# Altium project Marsault1.PrjPcb (part 7 of 7)

## Sheet Buzzer.SchDoc
size A4; SheetNumber: 8; SheetTotal: 9
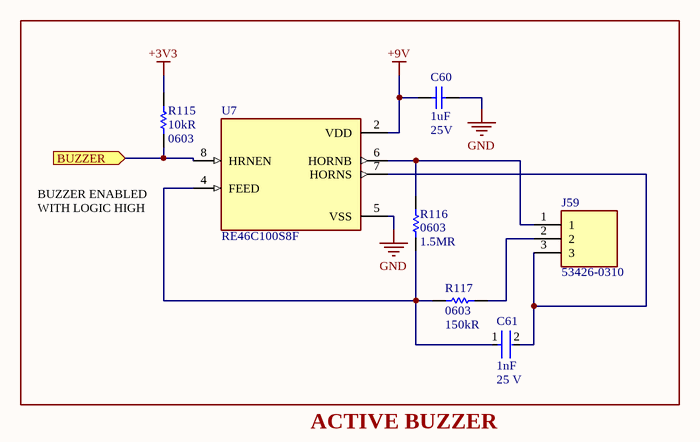
[diagram p7: Buzzer.SchDoc]

### Parts
C60  Capacitance: 1uF  Voltage Rating (DC): 25V  [CAPC1608X90X35LL15T15]  (hidden comment: C0603C105K3PAC7867)
C61  Capacitance: 1nF  Voltage Rating: 25 V  [FP-C0603C-CF-MFG]  (hidden comment: C0603C102J3GACTU)
J59  53426-0310  [534260310]
R115  Resistance: 10kR  Case Code (Imperial): 0603  [RESC1609X55X30LL15T15]  (hidden comment: ERJ3EKF1002V)
R116  Case Code (Imperial): 0603  Resistance: 1.5MR  [RESC1608X55X30ML15T15]  (hidden comment: ERJ-3GEYJ155V)
R117  Case Code (Imperial): 0603  Resistance: 150kR  [RESC1608X55X30NL15T15]  (hidden comment: ERJ-3EKF1503V)
U7  RE46C100S8F  [SOIC127P600X175-8N]

### Ports
BUZZER (in)

### Nets
+3V3: R115.2
+9V: C60.2 U7.2(VDD)
GND: C60.1 U7.5(VSS)
BUZZER: R115.1 U7.8(HRNEN) ; port BUZZER
NetC61_1: C61.1 R116.1 R117.1 U7.4(FEED)
NetC61_2: C61.2 J59.3 U7.7(HORNS)
NetJ59_1: J59.1 R116.2 U7.6(HORNB)
NetJ59_2: J59.2 R117.2

### Notes on the sheet
- BUZZER ENABLED WITH LOGIC HIGH
- ACTIVE BUZZER

### Library data of the parts
C60 = CMP-2006-02216-2: Manufacturer: Kemet; Manufacturer Part Number: C0603C105K3PACTU; Dielectric Material: Ceramic; Tolerance: 10%; Dielectric: X5R; Part Number: C0603C105K3PAC7867; Supplier 1: Mouser; Supplier Part Number 1: 80-C0603C105K3P; RoHS: Yes; Category: Ceramic Capacitors; Stock 1: 10085; Pricing 1: 1=0,30000, 10=0,15600, 50=0,15600, 100=0,09300, 500=0,08200, 1000=0,07300, 4000=0,05700, 10000=0,05700 (USD); Mount: Surface Mount,PCB; Case/Package: 0603; Number of Pins: 2; Case Code (Imperial): 0603; Case Code (Metric): 1608; Contact Plating: Tin,Matte; Min Operating Temperature: -55°C; Max Operating Temperature: 85°C; Packaging: Tape and Reel; Termination: SMD/SMT; Voltage Rating: 25V; Package Quantity: 4000; Voltage: 25V; Series: C0603C; Construction: Flat; Length: 1.6mm; Width: 0.031inch; Height: 0.8mm; Depth: 0.8mm; Thickness: 0.034inch; Radiation Hardening: No; REACH SVHC: No SVHC; RoHS Compliant: Yes; Lead Free: Lead Free; ComponentLink1URL: https://datasheet.ciiva.com/5998/40889-5998745.pdf?src-supplier=Farnell; ComponentLink1Description: https://datasheet.ciiva.com/5998/40889-5998745.pdf?src-supplier=Farnell; ComponentLink2URL: https://datasheet.ciiva.com/28610/1918694-28610792.pdf?src-supplier=Element14; ComponentLink2Description: https://datasheet.ciiva.com/28610/1918694-28610792.pdf?src-supplier=Element14
C61 = CMP-2006-03010-2: CAP CER 1000PF 25V 5% NP0 0603; Manufacturer: KEMET; Value: 1,000 pF; Tolerance: 0.05; Temperature Characteristic: C0G; Temperature Coefficient: 30ppm/°C; Automotive Grade: Grade 1; Material: Ceramic; Category: Cap; Device Class L2: Capacitors; Octopart: https://octopart.com/c0603c102j3gactu-kemet-8375722; ComponentLink2URL: https://api.kemet.com/component-edge/download/datasheet/C0603C100J5GACAUTO.pdf; Digikey Description: CAP CER 1000PF 25V 5% NP0 0603; Device Class L3: Ceramic Capacitors; Temperature Range Low: -55°C; Automotive: Yes; RoHS: TRUE; Temperature Range High: +125°C; ComponentLink2Description: Datasheet; Mouser Description: Multilayer Ceramic Capacitors MLCC - SMD/SMT 25volts 1000pF C0G 5%; Lead Free: Yes; Height: 0.87mm; Temperature: -55°C to +125°C; Manufacturer Part Number: C0603C102J3GACTU; Device Class L1: Passive Components; Package: C0603C-CF; Supplier 1: Mouser; Supplier Part Number 1: 80-C0603C102J3G; Stock 1: 70048; Pricing 1: 1=0,10000, 10=0,02700, 50=0,02700, 100=0,02200, 500=0,01600, 1000=0,01200, 4000=0,01000, 8000=0,00900, 10000=0,00900 (USD); Mount: Surface Mount; Case/Package: 0603; Number of Pins: 2; Case Code (Imperial): 0603; Case Code (Metric): 1608; Dielectric Material: Ceramic; Contact Plating: Tin,Matte; Min Operating Temperature: -55°C; Max Operating Temperature: 125°C; Packaging: Tape and Reel; Package Quantity: 1; Voltage Rating (DC): 25V; Dielectric: C0G; Termination: SMD/SMT; Series: C; Construction: Flat; Voltage: 25V; Length: 1.6mm; Width: 0.031inch; Thickness: 0.034inch; Depth: 0.8mm; Lead Pitch: 0.7mm; Radiation Hardening: No; RoHS Compliant: Yes; REACH SVHC: No SVHC; ComponentLink1URL: https://datasheet.ciiva.com/18192/getdatasheetpartid-127803-18192629.pdf?src-supplier=Verical; ComponentLink1Description: https://datasheet.ciiva.com/18192/getdatasheetpartid-127803-18192629.pdf?src-supplier=Verical; ComponentLink3URL: https://datasheet.ciiva.com/7823/f9080b-0402-series-c0g-7823966.pdf?src-supplier=Element14; ComponentLink3Description: https://datasheet.ciiva.com/7823/f9080b-0402-series-c0g-7823966.pdf?src-supplier=Element14; ComponentLink4URL: https://datasheet.ciiva.com/7823/f9080b-0402-series-c0g-7823967.pdf?src-supplier=Element14; ComponentLink4Description: https://datasheet.ciiva.com/7823/f9080b-0402-series-c0g-7823967.pdf?src-supplier=Element14
J59 = 53426-0310: Connector; Manufacturer_Name: Molex; Datasheet Link: https://www.molex.com/pdm_docs/sd/534260310_sd.pdf; Height: 6.9mm; Manufacturer_Part_Number: 53426-0310; Mouser Part Number: 538-53426-0310; Mouser Price/Stock: https://www.mouser.co.uk/ProductDetail/Molex/53426-0310?qs=X1mjqRbeMc5HPVciucBIlQ%3D%3D
R115 = CMP-1012-00623-3: Chip Resistor, 10 KOhm, +/- 1%, 0.1 W, -55 to 155 degC, 0603 (1608 Metric), RoHS, Tape and Reel; Manufacturer: Panasonic; Manufacturer Part Number: ERJ-3EKF1002V; Voltage Rating: 75V; Power Rating: 100mW; Temperature Coefficient: 100ppm\/degreesC; Case\/Package: 0603; Number of Pins: 2; Package Reference: 603; Depth: 0.8mm; Mount: SurfaceMount; Package Description: 2-Pin Surface Mount Device, Body 1.6 x 0.85 mm; Datasheet Version: 02/2017; Length: 1.6mm; Lead Free: LeadFree; Height: 0.45mm; Number of Terminations: 2; Max Power Dissipation: 100mW; Min Operating Temperature: -55degC; Datasheet URL: https://industrial.panasonic.com/cdbs/www-data/pdf/RDA0000/AOA0000C304.pdf; Termination: SMD/SMT; Case Code (Metric): 1608; Tolerance: 1%; Max Operating Temperature: 155degC; RoHSCompliant: true; Voltage Rating (DC): 75V; Radiation Hardening: No; Packaging: TapeandReel; Composition: ThickFilm; Mounting Technology: SurfaceMount; Manufacturer URL: http://www.panasonic.com/; Width: 0.031inch; REACH SVHC: NoSVHC; Contact Plating: Tin; Military Standard: Not; Package Quantity: 1; Supplier 1: Mouser; Supplier Part Number 1: 667-ERJ-3EKF1002V; RoHS: Yes; Category: Chip SMD Resistors; Stock 1: 20455; Pricing 1: 1=0,10000, 10=0,04000, 50=0,04000, 100=0,01700, 1000=0,00700, 5000=0,00500, 10000=0,00500 (USD); Case/Package: 0603; Size Code: 0603; Resistor Type: Thick Film; Series: ERJ; Resistance Tolerance: 1%; Construction: Rectangular; Features: Automotive AEC-Q200; Technology: THICK FILM; RoHS Compliant: Yes; ComponentLink1URL: https://datasheet.ciiva.com/16511/aoa0000ce2-16511861.pdf?src-supplier=Avnet+Asia; ComponentLink1Description: https://datasheet.ciiva.com/16511/aoa0000ce2-16511861.pdf?src-supplier=Avnet+Asia; ComponentLink2URL: https://datasheet.ciiva.com/46372/1678782-46372725.pdf?src-supplier=Element14; ComponentLink2Description: https://datasheet.ciiva.com/46372/1678782-46372725.pdf?src-supplier=Element14; ComponentLink3URL: https://datasheet.ciiva.com/28514/426256-28514198.pdf?src-supplier=Element14; ComponentLink3Description: https://datasheet.ciiva.com/28514/426256-28514198.pdf?src-supplier=Element14; ComponentLink4URL: https://datasheet.ciiva.com/9194/aoa0000ce2-9194199.pdf?src-supplier=Avnet; ComponentLink4Description: https://datasheet.ciiva.com/9194/aoa0000ce2-9194199.pdf?src-supplier=Avnet; ComponentLink5URL: https://datasheet.ciiva.com/7830/aoa0000ce2-7830729.pdf?src-supplier=Element14; ComponentLink5Description: https://datasheet.ciiva.com/7830/aoa0000ce2-7830729.pdf?src-supplier=Element14; ComponentLink6URL: https://datasheet.ciiva.com/17212/aoa0000ce2-17212105.pdf?src-supplier=Avnet+Europe; ComponentLink6Description: https://datasheet.ciiva.com/17212/aoa0000ce2-17212105.pdf?src-supplier=Avnet+Europe; ComponentLink7URL: https://datasheet.ciiva.com/30208/aoa0000ce2-30208985.pdf?src-supplier=Onlinecomponents.com; ComponentLink7Description: https://datasheet.ciiva.com/30208/aoa0000ce2-30208985.pdf?src-supplier=Onlinecomponents.com; ComponentLink8URL: https://datasheet.ciiva.com/48530/aoa0000ce2-48530988.pdf?src-supplier=Avnet; ComponentLink8Description: https://datasheet.ciiva.com/48530/aoa0000ce2-48530988.pdf?src-supplier=Avnet; ComponentLink9URL: https://datasheet.ciiva.com/24070/aoa0000ce2-24070318.pdf?src-supplier=Mouser; ComponentLink9Description: https://datasheet.ciiva.com/24070/aoa0000ce2-24070318.pdf?src-supplier=Mouser; ComponentLink10URL: https://datasheet.ciiva.com/16759/70260748-16759807.pdf?src-supplier=Allied+Electronics; ComponentLink10Description: https://datasheet.ciiva.com/16759/70260748-16759807.pdf?src-supplier=Allied+Electronics
R116 = CMP-2000-00727-1: Manufacturer: Panasonic; Tolerance: 5%; Temperature Coefficient: 150ppm/°C; Max Power Dissipation: 100mW; Voltage Rating (DC): 50V; Voltage Rating: 75V; Part Number: ERJ-3GEYJ155V; Supplier 1: Mouser; Supplier Part Number 1: 667-ERJ-3GEYJ155V; Manufacturer Part Number: ERJ-3GEYJ155V; RoHS: Yes; Category: Chip SMD Resistors; Stock 1: 76730; Pricing 1: 1=0,10000, 10=0,03400, 50=0,03400, 100=0,01400, 1000=0,00700, 2500=0,00600, 5000=0,00400, 10000=0,00400 (USD); Mount: Surface Mount; Case/Package: 0603; Case Code (Metric): 1608; Contact Plating: Tin; Min Operating Temperature: -55°C; Max Operating Temperature: 155°C; Packaging: Tape and Reel; Resistor Type: Thick Film; Package Quantity: 1; Number of Terminations: 2; Features: Automotive AEC-Q200; Series: ERJ; Power Rating: 100mW; Termination: SMD/SMT; Resistance Tolerance: 5%; Construction: Rectangular; Technology: THICK FILM; Length: 1.6mm; Width: 0.031inch; Height: 0.45mm; Depth: 0.8mm; RoHS Compliant: Yes; Lead Free: Lead Free; Military Standard: Not; REACH SVHC: No SVHC; ComponentLink1URL: https://datasheet.ciiva.com/11821/0900766b80f806dd-11821430.pdf?src-supplier=RSComponents; ComponentLink1Description: https://datasheet.ciiva.com/11821/0900766b80f806dd-11821430.pdf?src-supplier=RSComponents; ComponentLink2URL: https://datasheet.ciiva.com/16780/70255313-16780680.pdf?src-supplier=Allied+Electronics; ComponentLink2Description: https://datasheet.ciiva.com/16780/70255313-16780680.pdf?src-supplier=Allied+Electronics; ComponentLink3URL: https://datasheet.ciiva.com/9198/aoa0000ce1-9198090.pdf?src-supplier=Avnet; ComponentLink3Description: https://datasheet.ciiva.com/9198/aoa0000ce1-9198090.pdf?src-supplier=Avnet; ComponentLink4URL: https://datasheet.ciiva.com/30248/4aoa0000ce1-30248779.pdf?src-supplier=Onlinecomponents.com; ComponentLink4Description: https://datasheet.ciiva.com/30248/4aoa0000ce1-30248779.pdf?src-supplier=Onlinecomponents.com; ComponentLink5URL: https://datasheet.ciiva.com/5959/1500035-5959709.pdf?src-supplier=Farnell; ComponentLink5Description: https://datasheet.ciiva.com/5959/1500035-5959709.pdf?src-supplier=Farnell; ComponentLink6URL: https://datasheet.ciiva.com/28658/1678796-28658445.pdf?src-supplier=Element14; ComponentLink6Description: https://datasheet.ciiva.com/28658/1678796-28658445.pdf?src-supplier=Element14; ComponentLink7URL: https://datasheet.ciiva.com/15828/aoa0000ce1-15828430.pdf?src-supplier=Onlinecomponents.com; ComponentLink7Description: https://datasheet.ciiva.com/15828/aoa0000ce1-15828430.pdf?src-supplier=Onlinecomponents.com
R117 = CMP-1012-00754-2: Manufacturer: Panasonic; Power Rating: 100mW; Tolerance: 1%; Voltage Rating: 75V; Temperature Coefficient: 100ppm/°C; Part Number: ERJ-3EKF1503V; Supplier 1: Mouser; Supplier Part Number 1: 667-ERJ-3EKF1503V; Manufacturer Part Number: ERJ-3EKF1503V; RoHS: Yes; Category: Chip SMD Resistors; Stock 1: 1123; Pricing 1: 1=0,10000, 10=0,03700, 50=0,03700, 100=0,01500, 1000=0,00800, 2500=0,00700, 5000=0,00600, 10000=0,00600 (USD); Mount: Surface Mount; Case/Package: 0603; Number of Pins: 2; Case Code (Metric): 1608; Contact Plating: Tin; Weight: 7.1E-05oz; Min Operating Temperature: -55°C; Max Operating Temperature: 155°C; Packaging: Tape and Reel; Package Quantity: 1; Termination: SMD/SMT; Max Power Dissipation: 100mW; Resistor Type: Thick Film; Number of Terminations: 2; Features: Automotive AEC-Q200; Series: ERJ; Resistance Tolerance: 1%; Voltage Rating (DC): 75V; Construction: Rectangular; Length: 1.6mm; Width: 0.8mm; Height: 0.022inch; Depth: 0.8mm; Radiation Hardening: No; Military Standard: Not; Lead Free: Lead Free; RoHS Compliant: Yes; REACH SVHC: No SVHC; ComponentLink1URL: https://datasheet.ciiva.com/6137/aoa0000ce2-6137485.pdf?src-supplier=Farnell; ComponentLink1Description: https://datasheet.ciiva.com/6137/aoa0000ce2-6137485.pdf?src-supplier=Farnell; ComponentLink2URL: https://datasheet.ciiva.com/7909/aoa0000ce2-7909193.pdf?src-supplier=Element14; ComponentLink2Description: https://datasheet.ciiva.com/7909/aoa0000ce2-7909193.pdf?src-supplier=Element14; ComponentLink3URL: https://datasheet.ciiva.com/7909/426256-7909546.pdf?src-supplier=Element14; ComponentLink3Description: https://datasheet.ciiva.com/7909/426256-7909546.pdf?src-supplier=Element14; ComponentLink4URL: https://datasheet.ciiva.com/22687/1678782-22687434.pdf?src-supplier=Element14; ComponentLink4Description: https://datasheet.ciiva.com/22687/1678782-22687434.pdf?src-supplier=Element14; ComponentLink5URL: https://datasheet.ciiva.com/46420/1678782-46420173.pdf?src-supplier=Element14; ComponentLink5Description: https://datasheet.ciiva.com/46420/1678782-46420173.pdf?src-supplier=Element14; ComponentLink6URL: https://datasheet.ciiva.com/16787/70260748-16787015.pdf?src-supplier=Allied+Electronics; ComponentLink6Description: https://datasheet.ciiva.com/16787/70260748-16787015.pdf?src-supplier=Allied+Electronics; ComponentLink7URL: https://datasheet.ciiva.com/9185/aoa0000ce2-9185494.pdf?src-supplier=Avnet; ComponentLink7Description: https://datasheet.ciiva.com/9185/aoa0000ce2-9185494.pdf?src-supplier=Avnet; ComponentLink8URL: https://datasheet.ciiva.com/48530/aoa0000ce2-48530984.pdf?src-supplier=Avnet; ComponentLink8Description: https://datasheet.ciiva.com/48530/aoa0000ce2-48530984.pdf?src-supplier=Avnet; ComponentLink9URL: https://datasheet.ciiva.com/30145/aoa0000ce2-30145242.pdf?src-supplier=Onlinecomponents.com; ComponentLink9Description: https://datasheet.ciiva.com/30145/aoa0000ce2-30145242.pdf?src-supplier=Onlinecomponents.com; ComponentLink10URL: https://datasheet.ciiva.com/17207/aoa0000ce2-17207477.pdf?src-supplier=Avnet+Europe; ComponentLink10Description: https://datasheet.ciiva.com/17207/aoa0000ce2-17207477.pdf?src-supplier=Avnet+Europe
U7 = RE46C100S8F: MF: {'manufacturer': u'Microchip Technology'}; Value: *; Package: None; MP: RE46C100S8F; Price: None; Availability: Unavailable

## Nets that join several sheets
+3V3: MAIN (J3.1 J6.1), POWER (7 pins), MEMORIES (16 pins), MICROCONTROLLER (31 pins), SENSORS (27 pins), MOTOR1 (6 pins), MOTOR2 (6 pins), MOTOR3 (6 pins), MOTOR4 (6 pins), RADIO (R31.2 R32.2), Buzzer (R115.2)
+3V3_A: MICROCONTROLLER (C65.1 FB1.2 U4.33), SENSORS (C67.1 C69.1 U8.5 U9.5)
+9V: MAIN (J4.1), POWER (6 pins), Buzzer (C60.2 U7.2)
+VBAT: MAIN (J84.01 J84.03), POWER (F1.1)
+VBAT_MOTOR1: MAIN (J84.33 J84.35), POWER (F2.1)
+VBAT_MOTOR2: MAIN (J84.37 J84.39), POWER (F3.1)
GND: MAIN (56 pins), POWER (21 pins), MEMORIES (16 pins), MICROCONTROLLER (38 pins), SENSORS (43 pins), MOTOR1 (14 pins), MOTOR2 (14 pins), MOTOR3 (14 pins), MOTOR4 (14 pins), RADIO (23 pins), Buzzer (C60.1 U7.5)
VCC_PWR: POWER (R91.2 R94.2), MOTOR1 (11 pins), MOTOR2 (11 pins)
VCC_PWR: POWER (R93.2 R95.2), MOTOR3 (11 pins), MOTOR4 (11 pins)
~{CS_FLASH}: MAIN (J51.1 R68.2), MEMORIES (R9.1 U2.1)
~{CS_RADIO}: MAIN (J9.1 R34.2), RADIO (R31.1 U11.19)
~{CS_TEMP1}: MAIN (J77.1 R48.2), SENSORS (R145.1 U8.9)
~{CS_TEMP2}: MAIN (J2.1 R47.2), SENSORS (R146.1 U9.9)
~{DRDY_TEMP1}: MAIN (R51.2), SENSORS (U8.7)
~{DRDY_TEMP2}: MAIN (R52.2), SENSORS (U9.7)
~{FAULT_TEMP1}: MAIN (R50.2), SENSORS (U8.13)
~{FAULT_TEMP2}: MAIN (R49.2), SENSORS (U9.13)
~{RST_GPS}: MAIN (J69.1 R33.1), MICROCONTROLLER (U4.27)
AERO_CON: MAIN (J84.07), SENSORS (R106.1 R107.2)
AEROCONTACT: MAIN (J23.1 R46.2), SENSORS (U1.4)
ANT_ON: MAIN (J68.1 R23.1), MICROCONTROLLER (U4.29)
BUZZER: MAIN (J49.1 R59.2), Buzzer (R115.1 U7.8)
DIO0: MAIN (R44.2), RADIO (U11.8)
DIO1: MAIN (R43.2), RADIO (U11.9)
DIO2: MAIN (R40.2), RADIO (U11.10)
DIO3: MAIN (R39.2), RADIO (U11.11)
DIO4: MAIN (R38.2), RADIO (U11.12)
DIO5: MAIN (R37.2), RADIO (U11.13)
DIR_M1: MAIN (J11.1 R57.1), MOTOR1 (IC6_MOTOR1.1 R108_MOTOR1.1)
DIR_M2: MAIN (J12.1 R62.1), MOTOR2 (IC6_MOTOR2.1 R108_MOTOR2.1)
DIR_M3: MAIN (J16.1 R70.1), MOTOR3 (IC6_MOTOR3.1 R108_MOTOR3.1)
DIR_M4: MAIN (J33.1 R80.1), MOTOR4 (IC6_MOTOR4.1 R108_MOTOR4.1)
EN_M1: MAIN (J17.1 R58.1), MOTOR1 (IC6_MOTOR1.6 R111_MOTOR1.1)
EN_M2: MAIN (J34.1 R63.1), MOTOR2 (IC6_MOTOR2.6 R111_MOTOR2.1)
EN_M3: MAIN (J14.1 R72.1), MOTOR3 (IC6_MOTOR3.6 R111_MOTOR3.1)
EN_M4: MAIN (J25.1 R81.1), MOTOR4 (IC6_MOTOR4.6 R111_MOTOR4.1)
EXT_INT_GPS: MAIN (J67.1 R22.1), MICROCONTROLLER (U4.28)
HOT_L: MAIN (J1.22), MOTOR1 (6 pins)
HOT_L: MAIN (J1.28), MOTOR3 (6 pins)
HOT_L: MAIN (J1.34), MOTOR2 (6 pins)
HOT_L: MAIN (J1.40), MOTOR4 (6 pins)
HOT_R: MAIN (J1.20), MOTOR1 (6 pins)
HOT_R: MAIN (J1.26), MOTOR3 (6 pins)
HOT_R: MAIN (J1.32), MOTOR2 (6 pins)
HOT_R: MAIN (J1.38), MOTOR4 (6 pins)
IBAT_FB: MAIN (J18.1 R71.2), POWER (IC2.1)
IBAT_MOTOR1_FB: MAIN (J39.1 R74.2), POWER (IC3.1)
IBAT_MOTOR2_FB: MAIN (J27.1 R77.2), POWER (IC5.1)
IMOTOR1: MAIN (J57.1 R60.1), MOTOR1 (IC4_MOTOR1.1)
IMOTOR2: MAIN (J36.1 R65.1), MOTOR2 (IC4_MOTOR2.1)
IMOTOR3: MAIN (J47.1 R75.1), MOTOR3 (IC4_MOTOR3.1)
IMOTOR4: MAIN (J58.1 R82.1), MOTOR4 (IC4_MOTOR4.1)
INT_IMU: MAIN (R45.2), SENSORS (R21.1 U5.6)
MISO: MAIN (R6.2), SENSORS (U8.11 U9.11)
MISO_MEM: MAIN (J75.1 R6.1 R66.2), MEMORIES (U2.2)
MISO_RADIO: MAIN (J42.1 R53.2), RADIO (U11.17)
MOSI: MAIN (R7.2), SENSORS (U8.12 U9.12)
MOSI_MEM: MAIN (J78.1 R7.1 R67.2), MEMORIES (U2.5)
MOSI_RADIO: MAIN (J50.1 R54.2), RADIO (U11.18)
NetIC9_4: MAIN (R22.2), SENSORS (IC9.4)
NetIC9_8: MAIN (R33.2), SENSORS (IC9.8 R121.1)
NetIC9_14: MAIN (R23.2), SENSORS (IC9.14 R123.2)
NetIC9_20: MAIN (R8.2), SENSORS (IC9.20)
NetIC9_21: MAIN (R19.2), SENSORS (IC9.21)
NetR26_2: MAIN (R26.2), SENSORS (U5.2 U6.4)
NetR28_2: MAIN (R28.2), SENSORS (U5.3 U6.3)
NetR34_1: MAIN (R34.1), MICROCONTROLLER (U4.73)
NetR35_1: MAIN (R35.1), MICROCONTROLLER (U4.2)
NetR36_1: MAIN (R36.1), MICROCONTROLLER (U4.1)
NetR37_1: MAIN (R37.1), MICROCONTROLLER (U4.142)
NetR38_1: MAIN (R38.1), MICROCONTROLLER (U4.141)
NetR39_1: MAIN (R39.1), MICROCONTROLLER (U4.140)
NetR40_1: MAIN (R40.1), MICROCONTROLLER (U4.139)
NetR43_1: MAIN (R43.1), MICROCONTROLLER (U4.137)
NetR44_1: MAIN (R44.1), MICROCONTROLLER (U4.136)
NetR45_1: MAIN (R45.1), MICROCONTROLLER (U4.12)
NetR46_1: MAIN (R46.1), MICROCONTROLLER (U4.22)
NetR47_1: MAIN (R47.1), MICROCONTROLLER (U4.53)
NetR48_1: MAIN (R48.1), MICROCONTROLLER (U4.56)
NetR49_1: MAIN (R49.1), MICROCONTROLLER (U4.54)
NetR50_1: MAIN (R50.1), MICROCONTROLLER (U4.57)
NetR51_1: MAIN (R51.1), MICROCONTROLLER (U4.55)
NetR52_1: MAIN (R52.1), MICROCONTROLLER (U4.50)
NetR53_1: MAIN (R53.1), MICROCONTROLLER (U4.75)
NetR54_1: MAIN (R54.1), MICROCONTROLLER (U4.76)
NetR55_1: MAIN (R55.1), MICROCONTROLLER (U4.74)
NetR56_2: MAIN (R56.2), MICROCONTROLLER (U4.41)
NetR57_2: MAIN (R57.2), MICROCONTROLLER (U4.42)
NetR58_2: MAIN (R58.2), MICROCONTROLLER (U4.44)
NetR59_1: MAIN (R59.1), MICROCONTROLLER (U4.118)
NetR60_2: MAIN (R60.2), MICROCONTROLLER (U4.43)
NetR61_2: MAIN (R61.2), MICROCONTROLLER (U4.46)
NetR62_2: MAIN (R62.2), MICROCONTROLLER (U4.49)
NetR63_2: MAIN (R63.2), MICROCONTROLLER (U4.48)
NetR64_1: MAIN (R64.1), MICROCONTROLLER (U4.128)
NetR65_2: MAIN (R65.2), MICROCONTROLLER (U4.47)
NetR66_1: MAIN (R66.1), MICROCONTROLLER (U4.127)
NetR67_1: MAIN (R67.1), MICROCONTROLLER (U4.129)
NetR68_1: MAIN (R68.1), MICROCONTROLLER (U4.126)
NetR69_2: MAIN (R69.2), MICROCONTROLLER (U4.60)
NetR70_2: MAIN (R70.2), MICROCONTROLLER (U4.59)
NetR71_1: MAIN (R71.1), MICROCONTROLLER (U4.26)
NetR72_2: MAIN (R72.2), MICROCONTROLLER (U4.58)
NetR73_1: MAIN (R73.1), MICROCONTROLLER (U4.19)
NetR74_1: MAIN (R74.1), MICROCONTROLLER (U4.21)
NetR75_2: MAIN (R75.2), MICROCONTROLLER (U4.40)
NetR76_1: MAIN (R76.1), MICROCONTROLLER (U4.18)
NetR77_1: MAIN (R77.1), MICROCONTROLLER (U4.20)
NetR78_1: MAIN (R78.1), MICROCONTROLLER (U4.15)
NetR79_2: MAIN (R79.2), MICROCONTROLLER (U4.67)
NetR80_2: MAIN (R80.2), MICROCONTROLLER (U4.68)
NetR81_2: MAIN (R81.2), MICROCONTROLLER (U4.69)
NetR82_2: MAIN (R82.2), MICROCONTROLLER (U4.37)
NetR83_2: MAIN (R83.2), MICROCONTROLLER (U4.77)
NetR84_2: MAIN (R84.2), MICROCONTROLLER (U4.78)
NetR85_2: MAIN (R85.2), MICROCONTROLLER (U4.79)
NetR118_2: MAIN (R118.2), MICROCONTROLLER (U4.80)
NetR124_2: MAIN (R124.2), MICROCONTROLLER (U4.81)
NetR125_2: MAIN (R125.2), MICROCONTROLLER (U4.82)
NetR126_2: MAIN (R126.2), MICROCONTROLLER (U4.85)
NetR127_2: MAIN (R127.2), MICROCONTROLLER (U4.86)
NetR128_2: MAIN (R128.2), MICROCONTROLLER (U4.122)
NetR129_2: MAIN (R129.2), MICROCONTROLLER (U4.119)
NRST_RADIO: MAIN (J48.1 R35.2), RADIO (R32.1 U11.7)
PWM_M1: MAIN (J13.1 R56.1), MOTOR1 (IC6_MOTOR1.11 R112_MOTOR1.2)
PWM_M2: MAIN (J24.1 R61.1), MOTOR2 (IC6_MOTOR2.11 R112_MOTOR2.2)
PWM_M3: MAIN (J35.1 R69.1), MOTOR3 (IC6_MOTOR3.11 R112_MOTOR3.2)
RF_MOD: MAIN (J22.1 R36.2), RADIO (U11.20)
SCK_MEM: MAIN (J76.1 R4.1 R64.2), MEMORIES (U2.6)
SCK_RADIO: MAIN (J41.1 R55.2), RADIO (U11.16)
SCL: MAIN (J72.1 R26.1), MICROCONTROLLER (R120.1 U4.11)
SCLK: MAIN (R4.2), SENSORS (U8.10 U9.10)
SDA: MAIN (J70.1 R28.1), MICROCONTROLLER (R119.1 U4.10)
SDCLK: MAIN (J28.1), MEMORIES (R170.1), MICROCONTROLLER (U4.113)
SDCMD: MAIN (J29.1), MEMORIES (R167.1 R169.1), MICROCONTROLLER (U4.116)
SDDATA0: MAIN (J7.1), MEMORIES (R165.1 R171.1), MICROCONTROLLER (U4.98)
SDDATA1: MAIN (J8.1), MEMORIES (R164.1 R172.1), MICROCONTROLLER (U4.99)
SDDATA2: MAIN (J20.1), MEMORIES (R163.1 R173.1), MICROCONTROLLER (U4.111)
SDDATA3: MAIN (J21.1), MEMORIES (R166.1 R168.1), MICROCONTROLLER (U4.112)
TH1_CON_N: MAIN (J84.13), SENSORS (C70.1 C72.1 U8.2 U8.3)
TH1_CON_P: MAIN (J84.11), SENSORS (C70.2 C73.1 U8.4)
TH2_CON_N: MAIN (J84.19), SENSORS (C71.1 C74.1 U9.2 U9.3)
TH2_CON_P: MAIN (J84.17), SENSORS (C71.2 C75.1 U9.4)
UART_RX_GPS: MAIN (J73.1 R19.1), MICROCONTROLLER (U4.34)
UART_TX_GPS: MAIN (J71.1 R8.1), MICROCONTROLLER (U4.35)
VBAT_FB: MAIN (J26.1 R73.2), POWER (C1.2 R87.1 R89.2)
VBAT_MOTOR1_FB: MAIN (J19.1 R76.2), POWER (C10.2 R94.1 R98.2)
VBAT_MOTOR2_FB: MAIN (J40.1 R78.2), POWER (C9.2 R95.1 R99.2)